# Altium schematic sheet 12V DC.SchDoc
size A3; SheetNumber: 1; SheetTotal: 1
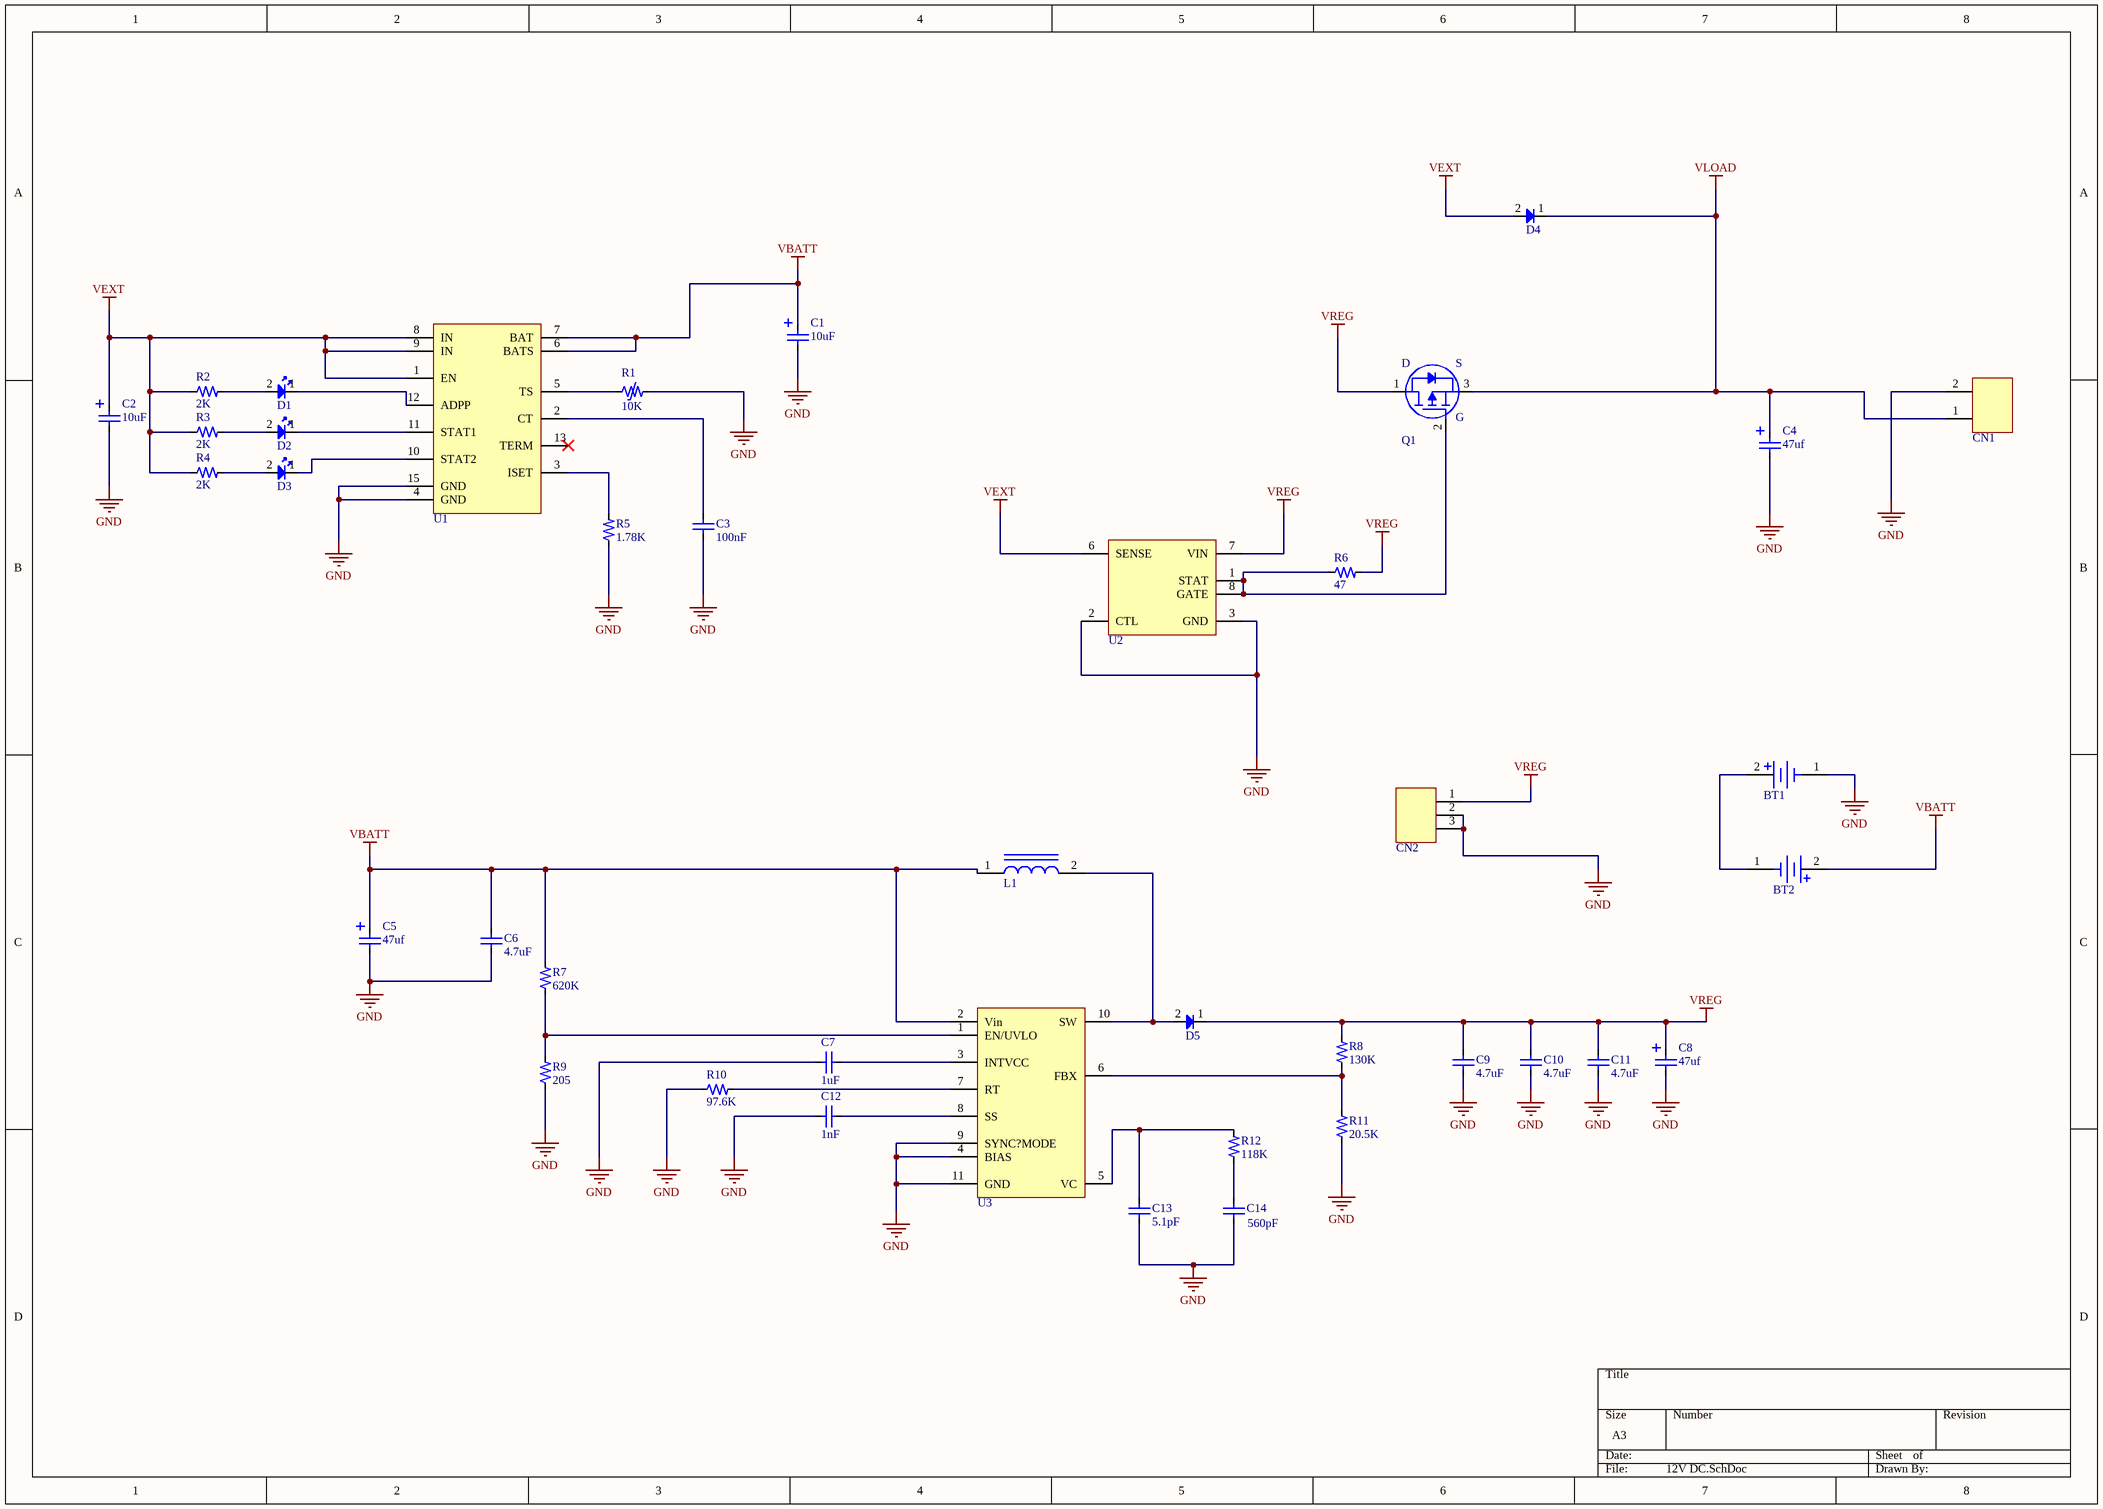
[diagram p0: 12V DC.SchDoc]

## Parts
BT1  BK-18650-PC2  [18650]  (value not drawn)
BT2  BK-18650-PC2  [18650]  (value not drawn)
C1  value 10uF  [CAP_3216]  (hidden comment: CAP_POL)
C2  value 10uF  [CAP_3216]  (hidden comment: CAP_POL)
C3  value 100nF  [Capacitor_0402]  (hidden comment: Capacitor_0402)
C4  value 47uf  [CAP_1206]  (hidden comment: CAP_1206)
C5  value 47uf  [CAP_1206]  (hidden comment: CAP_1206)
C6  value 4.7uF  [Capacitor_0603]  (hidden comment: Capacitor_0603)
C7  value 1uF  [Capacitor_0402]  (hidden comment: Capacitor_0402)
C8  value 47uf  [CAP_1206]  (hidden comment: CAP_1206)
C9  value 4.7uF  [Capacitor_0603]  (hidden comment: Capacitor_0603)
C10  value 4.7uF  [Capacitor_0603]  (hidden comment: Capacitor_0603)
C11  value 4.7uF  [Capacitor_0603]  (hidden comment: Capacitor_0603)
C12  value 1nF  [Capacitor_0402]  (hidden comment: Capacitor_0402)
C13  value 5.1pF  [Capacitor_0402]  (hidden comment: Capacitor_0402)
C14  value 560pF  [Capacitor_0402]  (hidden comment: Capacitor_0402)
CN1  2 Position Wire Terminal  [282834-2]  (value not drawn)
CN2  PJ-202A  [PJ-202A]  (value not drawn)
D1  LED  [LED_0402]  (value not drawn)
D2  LED  [LED_0402]  (value not drawn)
D3  LED  [LED_0402]  (value not drawn)
D4  CDBA240LL-HF  [DO-214AC]  (value not drawn)
D5  CDBA240LL-HF  [DO-214AC]  (value not drawn)
L1  IHLP4040DZER5R6M01  [Inductor_4040]  (value not drawn)
Q1  DMP2045U-7  [SOT-23]  (value not drawn)
R1  value 10K  [Resistor_0402]  (hidden comment: Thermistor_0402)
R2  value 2K  [Resistor_0603]  (hidden comment: Resistor_0603)
R3  value 2K  [Resistor_0603]  (hidden comment: Resistor_0603)
R4  value 2K  [Resistor_0603]  (hidden comment: Resistor_0603)
R5  value 1.78K  [Resistor_0603]  (hidden comment: Resistor_0603)
R6  value 47  [Resistor_0603]  (hidden comment: Resistor_0603)
R7  value 620K  [Resistor_0603]  (hidden comment: Resistor_0603)
R8  value 130K  [Resistor_0402]  (hidden comment: Resistor_0402)
R9  value 205  [Resistor_0603]  (hidden comment: Resistor_0603)
R10  value 97.6K  [Resistor_0402]  (hidden comment: Resistor_0402)
R11  value 20.5K  [Resistor_0603]  (hidden comment: Resistor_0603)
R12  value 118K  [Resistor_0402]  (hidden comment: Resistor_0402)
U1  AAT3663IWO-8.4-2-T1  [14-TDFN]  (value not drawn)
U2  LTC4414EMS8#PBF  [8-MSOP]  (value not drawn)
U3  LT8362EDD#PBF  [10-DFN]  (value not drawn)

## Nets
GND: BT1.1(NEG) C1.1 C2.1 C3.1 C4.1 C5.1 C6.1 C7.1 C8.1 C9.1 C10.2 C11.1 C12.1 C13.1 C14.1 CN1.2 CN2.2 CN2.3 R1.2 R5.1 R9.1 R10.1 R11.1 U1.4(GND) U1.15(GND) U2.2(CTL) U2.3(GND) U3.4(BIAS) U3.9(SYNC?MODE) U3.11(GND)
VBATT: BT2.2(POS) C1.2 C5.2 C6.2 L1.1 R7.2 U1.6(BATS) U1.7(BAT) U3.2(Vin)
VEXT: C2.2 D4.2 R2.1 R3.1 R4.1 U1.1(EN) U1.8(IN) U1.9(IN) U2.6(SENSE)
VLOAD: C4.2 CN1.1 D4.1 Q1.3(S)
VREG: C8.2 C9.2 C10.1 C11.2 CN2.1 D5.1 Q1.1(D) R6.2 R8.2 U2.7(VIN)
NetBT1_2: BT1.2(POS) BT2.1(NEG)
NetC3_2: C3.2 U1.2(CT)
NetC7_2: C7.2 U3.3(INTVCC)
NetC12_2: C12.2 U3.8(SS)
NetC13_2: C13.2 R12.2 U3.5(VC)
NetC14_2: C14.2 R12.1
NetD1_1: D1.1 U1.12(ADPP)
NetD1_2: D1.2 R2.2
NetD2_1: D2.1 U1.11(STAT1)
NetD2_2: D2.2 R3.2
NetD3_1: D3.1 U1.10(STAT2)
NetD3_2: D3.2 R4.2
NetD5_2: D5.2 L1.2 U3.10(SW)
NetQ1_2: Q1.2(G) R6.1 U2.1(STAT) U2.8(GATE)
NetR1_1: R1.1 U1.5(TS)
NetR5_2: R5.2 U1.3(ISET)
NetR7_1: R7.1 R9.2 U3.1(EN/UVLO)
NetR8_1: R8.1 R11.2 U3.6(FBX)
NetR10_2: R10.2 U3.7(RT)

Not connected (* = marked no-connect by the designer): U1 13(TERM)*

## Library data of the parts
BT1 BT2 = BATT HOLDER 18650 1 CELL PC PIN: Manufacturer Name 1: MPD (Memory Protection Devices); ID: 16; Pin: 2; Price: $3.75; Manufacturer Name P/N 1: BK-18650-PC2
C1 C2 = CAP TANT 10uF 10V ±10%: Manufacturer Name 1: KEMET; Manufacturer Name P/N 1: B45196H2106K109; Voltage: 10V; Tolerance: ±10%; ID: 6; Features: Tantalum 3216-18 10uF; Footprint: 3216-18; Operating Temperature: -55°C ~ 125°C; Price: $0.064; Manufacturer Name 2: Vishay; Manufacturer Name P/N 2: 593D106X9010A2TE3
C3 = CAP CER 100nF 50V ±10% X7R 0402: Manufacturer Name 1: KEMET; Manufacturer Name P/N 1: C0402C104K5RACTU; Voltage: 50V; Type: X7R; Tolerance: ±10%; ID: 1; Features: 0402 100nF; Footprint: 0402; Operating Temperature: -55°C ~ 125°C; Price: $0,010; Manufacturer Name 2: Murata Electronics; Manufacturer Name P/N 2: GRM21BR71H104K01L
C4 C5 C8 = CAP TANT 47UF ±20% 6.3V 1206: Manufacturer Name 1: KYOCERA AVX; Voltage: 6.3V; Tolerance: ±20%; ID: 10; Features: Tantalum 1206 47uF; Footprint: 1206; Operating Temperature: -55°C ~ 125°C; Price: $0.42
C6 C9-C11 = CAP CER 4.7UF ±10% 10V X5R 0603: Manufacturer Name 1: Samsung Electro-Mechanics; Manufacturer Name P/N 1: CL10A475KP8NNNC; Voltage: 10V; Type: X5R; Tolerance: ±10%; ID: 11; Features: 0603 4.7uF; Footprint: 0603; Operating Temperature: -55°C ~ 85°C; Price: $0.10
C7 = CAP CER 1UF ±10% 6.3V X5R 0402: Manufacturer Name 1: Taiyo Yuden; Manufacturer Name P/N 1: JMK105BJ105KV-F; Voltage: 6.3V; Type: X5R; Tolerance: ±10%; ID: 12; Features: 0402 1uF; Footprint: 0402; Operating Temperature: -55°C ~ 85°C; Price: $0.10
C12 = CAP CER 1NF 50V ±10% X7R 0402: Manufacturer Name 1: KEMET; Manufacturer Name P/N 1: C0402C102K5REC7867; Voltage: 50v; Type: X7R; Tolerance: ±10%; ID: 9; Features: 0402 1NF; Footprint: 0402; Operating Temperature: -55°C ~ 125°C; Price: $0.10
C13 = CAP CER 5.1PF ±0.25pF 50V C0G/NP0 0402: Manufacturer Name 1: Murata Electronics; Manufacturer Name P/N 1: GRM1555C1H5R1CA01D; Voltage: 50V; Tolerance: ±0.25pF; ID: 13; Type: C0G/NP0; Features: 0402 5.1PF; Footprint: 0402; Operating Temperature: -55°C ~ 125°C; Price: $0.10
C14 = CAP CER 560PF ±5% 50V C0G/NP0 0402: Manufacturer Name 1: Murata Electronics; Manufacturer Name P/N 1: GRM1555C1H561JA01D; Voltage: 50V; ID: 14; Type: C0G/NP0; Features: 0402 560pF; Footprint: 0402; Tolerance: 560pF; Operating Temperature: -55°C ~ 125°C; Price: $0.10
CN1 = TERM BLK 2P SIDE ENT 2.54MM PCB: Manufacturer Name 1: TE Connectivity AMP Connectors; Current Rating: 10A; ID: 15; Pin: 2; Price: $1.42; Manufacturer Name P/N 1: 282834-2
CN2 = CONN PWR JACK 2X5.5MM KINKED PIN: Manufacturer Name 1: CUI Devices; ID: 1; Pin: 3; Footprint: PJ-202; Price: $0.690; Manufacturer Name P/N 1: PJ-202A
D1-D3 = LED RED 0402: Manufacturer Name 1: Vishay; Manufacturer Name P/N 1: VLMS1500-GS08; Voltage: 2V; Current: 30mA; Power: 0.06W; ID: 1; Pin: 2; Features: RED 0402; Footprint: 0402; Price: $0.196
D4 D5 = DIODE SCHOTTKY 40V 2A DO214AC: Manufacturer Name 1: Comchip Technology; Voltage: 40v; Current: 2A; ID: 7; Pin: 2; Features: DIODE SCHOTTKY; Operating Temperature: -55°C ~ 100°C; Manufacturer Name P/N 1: CDBA240LL-HF
L1 = FIXED IND 5.6UH 8.5A 19.3MOHM SM: Manufacturer Name 1: Vishay Dale; Value: 100 kHz; Current: 8.5A; Tolerance: ±20%; ID: 2; Features: 4040 8.5 A 19.3mOhm; Footprint: 4040; Operating Temperature: -55°C ~ 125°C; Price: $1.40; Manufacturer Name P/N 1: IHLP4040DZER5R6M01
Q1 = MOSFET P-CH 20V 4.3A SOT23-3: P-Channel 20 V 4.3A (Ta) 800mW (Ta) Surface Mount SOT-23-3; Manufacturer Name 1: Diodes Incorporated; Voltage: 20 V; ID: 2; Current: 4.3A; Features: P-Channel 8-MSOP  SOT23-3; Footprint: SOT-23-3; Operating Temperature: -55°C ~ 150°C (TJ); Price: $0.46; Manufacturer Name P/N 1: DMP2045U-7
R1 = THERMISTOR NTC 10K 3380K 0402 ±3%: Manufacturer Name 1: Panasonic Electronic Components; Manufacturer Name P/N 1: ERT-J0EG103HA; Power: 66 mW; Tolerance: ±3%; ID: 11; Features: CHIP0402; Footprint: 0402; Operating Temperature: -40°C ~ 125°C; Price: $0.11
R2-R4 = CHIP RES 2K 100 mW 0603 ±1%: Manufacturer Name 1: Panasonic Electronic Components; Manufacturer Name P/N 1: ERJ-3EKF2001V; Power: 100mW; Tolerance: ±1%; ID: 9; Features: CHIP0603; Footprint: 0603; Operating Temperature: -55°C ~ 155°C; Price: $0.10
R5 = CHIP RES 1.78K 100 mW 0603 ±1%: Manufacturer Name 1: KOA Speer Electronics, Inc.; Manufacturer Name P/N 1: RK73H1JTTD1781F; Power: 100mW; Tolerance: ±1%; ID: 10; Features: CHIP0603; Footprint: 0603; Operating Temperature: -55°C ~ 155°C; Price: $0.10
R6 = CHIP RES 47 100 mW 0603 ±0.1%: Manufacturer Name 1: Vishay; Manufacturer Name P/N 1: MCS04020C4709FE000; Power: 100mW; Tolerance: ±1%; ID: 4; Features: CHIP 0603; Footprint: 0603; Operating Temperature: -55°C ~ 125°C; Price: $0.06; Manufacturer Name 2: KOA Speer; Manufacturer Name P/N 2: RK73G1ETTP47R0F
R7 = CHIP RES 620K 100mW 0603 ±1%: Manufacturer Name 1: YAGEO; Manufacturer Name P/N 1: RC0603FR-07620KL; Power: 100mW; Tolerance: ±1%; ID: 12; Features: CHIP0603; Footprint: 0603; Operating Temperature: -55°C ~ 155°C; Price: $0.10
R8 = CHIP RES 130K 100mW 0402 ±1%: Manufacturer Name 1: Panasonic Electronic Components; Manufacturer Name P/N 1: ERJ-2RKF1303X; Power: 100mW; Tolerance: ±1%; ID: 14; Features: CHIP0402; Footprint: 0402; Operating Temperature: -55°C ~ 155°C; Price: $0.10
R9 = CHIP RES 205 100 mW 0603  ±1%: Manufacturer Name 1: YAGEO; Manufacturer Name P/N 1: RC0603FR-07205RL; Power: 100mW; Tolerance: ±1%; ID: 11; Features: CHIP0603; Footprint: 0603; Operating Temperature: -55°C ~ 155°C; Price: $0.10
R10 = CHIP RES 97.6K 63 mW 0402 ±1%: Manufacturer Name 1: YAGEO; Manufacturer Name P/N 1: RC0402FR-0797K6L; Power: 63mW; Tolerance: ±1%; ID: 10; Features: CHIP0402; Footprint: 0402; Operating Temperature: -55°C ~ 155°C; Price: $0.10
R11 = CHIP RES 20.5K 100mW 0603 ±1%: Manufacturer Name 1: YAGEO; Manufacturer Name P/N 1: RC0603FR-0720K5L; Power: 100mW; Tolerance: ±1%; ID: 15; Features: CHIP0603; Footprint: 0603; Operating Temperature: -55°C ~ 155°C; Price: $0.10
R12 = CHIP RES 118K 100mW 0402 ±1%: Manufacturer Name 1: Panasonic Electronic Components; Manufacturer Name P/N 1: ERJ-2RKF1183X; Power: 100mW; Tolerance: ±1%; ID: 13; Features: CHIP0402; Footprint: 0402; Operating Temperature: -55°C ~ 155°C; Price: $0.10
U1 = IC BATT CHG LI-ION 2CELL 14TDFN: Manufacturer Name 1: Skyworks Solutions Inc.; Operating Voltage: 13.2V; Operating Current: 1A; ID: 13; Features: Charger IC Lithium; Pin: 14; Operating Temperature: -40°C ~ 85°C (TA); Price: $0.00; Manufacturer Name P/N 1: AAT3663IWO-8.4-2-T1
U2 = IC OR CTRLR SRC SELECT 8MSOP: Manufacturer Name 1: Analog Devices Inc.; Operating Voltage: 3V ~ 36V; ID: 15; Features: Source Selector Switch P-Channel; Pin: 8; Operating Temperature: -40°C ~ 85°C; Price: $6.02; Manufacturer Name P/N 1: LTC4414EMS8#PBF
U3 = IC REG BST SEPIC 2A 10DFN: Manufacturer Name 1: Analog Devices Inc.; Operating Current: 2A; ID: 16; Features: Boost, SEPIC Switching Regulator; Pin: 10; Operating Temperature: -40°C ~ 125°C (TJ); Price: $5.83; Manufacturer Name P/N 1: LT8362EDD#PBF